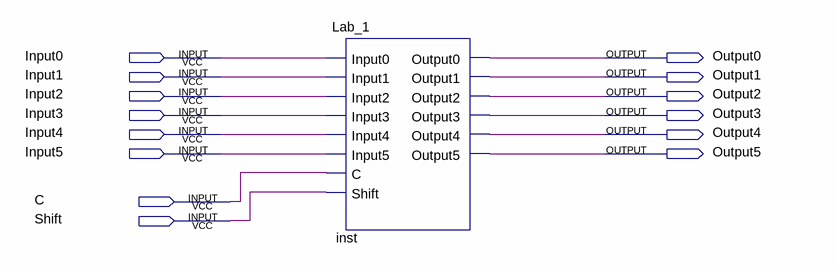
[diagram p0: schematic sheet]
// Quartus schematic Block3.bdf as structural Verilog: 1 symbols, 14 pins
module Block3 (
  input  Input0,
  input  Input1,
  input  Input2,
  input  Input3,
  input  Input4,
  input  Input5,
  input  C,
  input  Shift,
  output Output0,
  output Output1,
  output Output2,
  output Output3,
  output Output4,
  output Output5
);

  Lab_1 inst (
    .Input0(Input0), .Input1(Input1), .Input2(Input2), .Input3(Input3), .Input4(Input4), .Input5(Input5),
    .C(C), .Shift(Shift), .Output0(Output0), .Output1(Output1), .Output2(Output2), .Output3(Output3),
    .Output4(Output4), .Output5(Output5));
endmodule
